# Altium schematic sheet MotherBoard.SchDoc
size A2
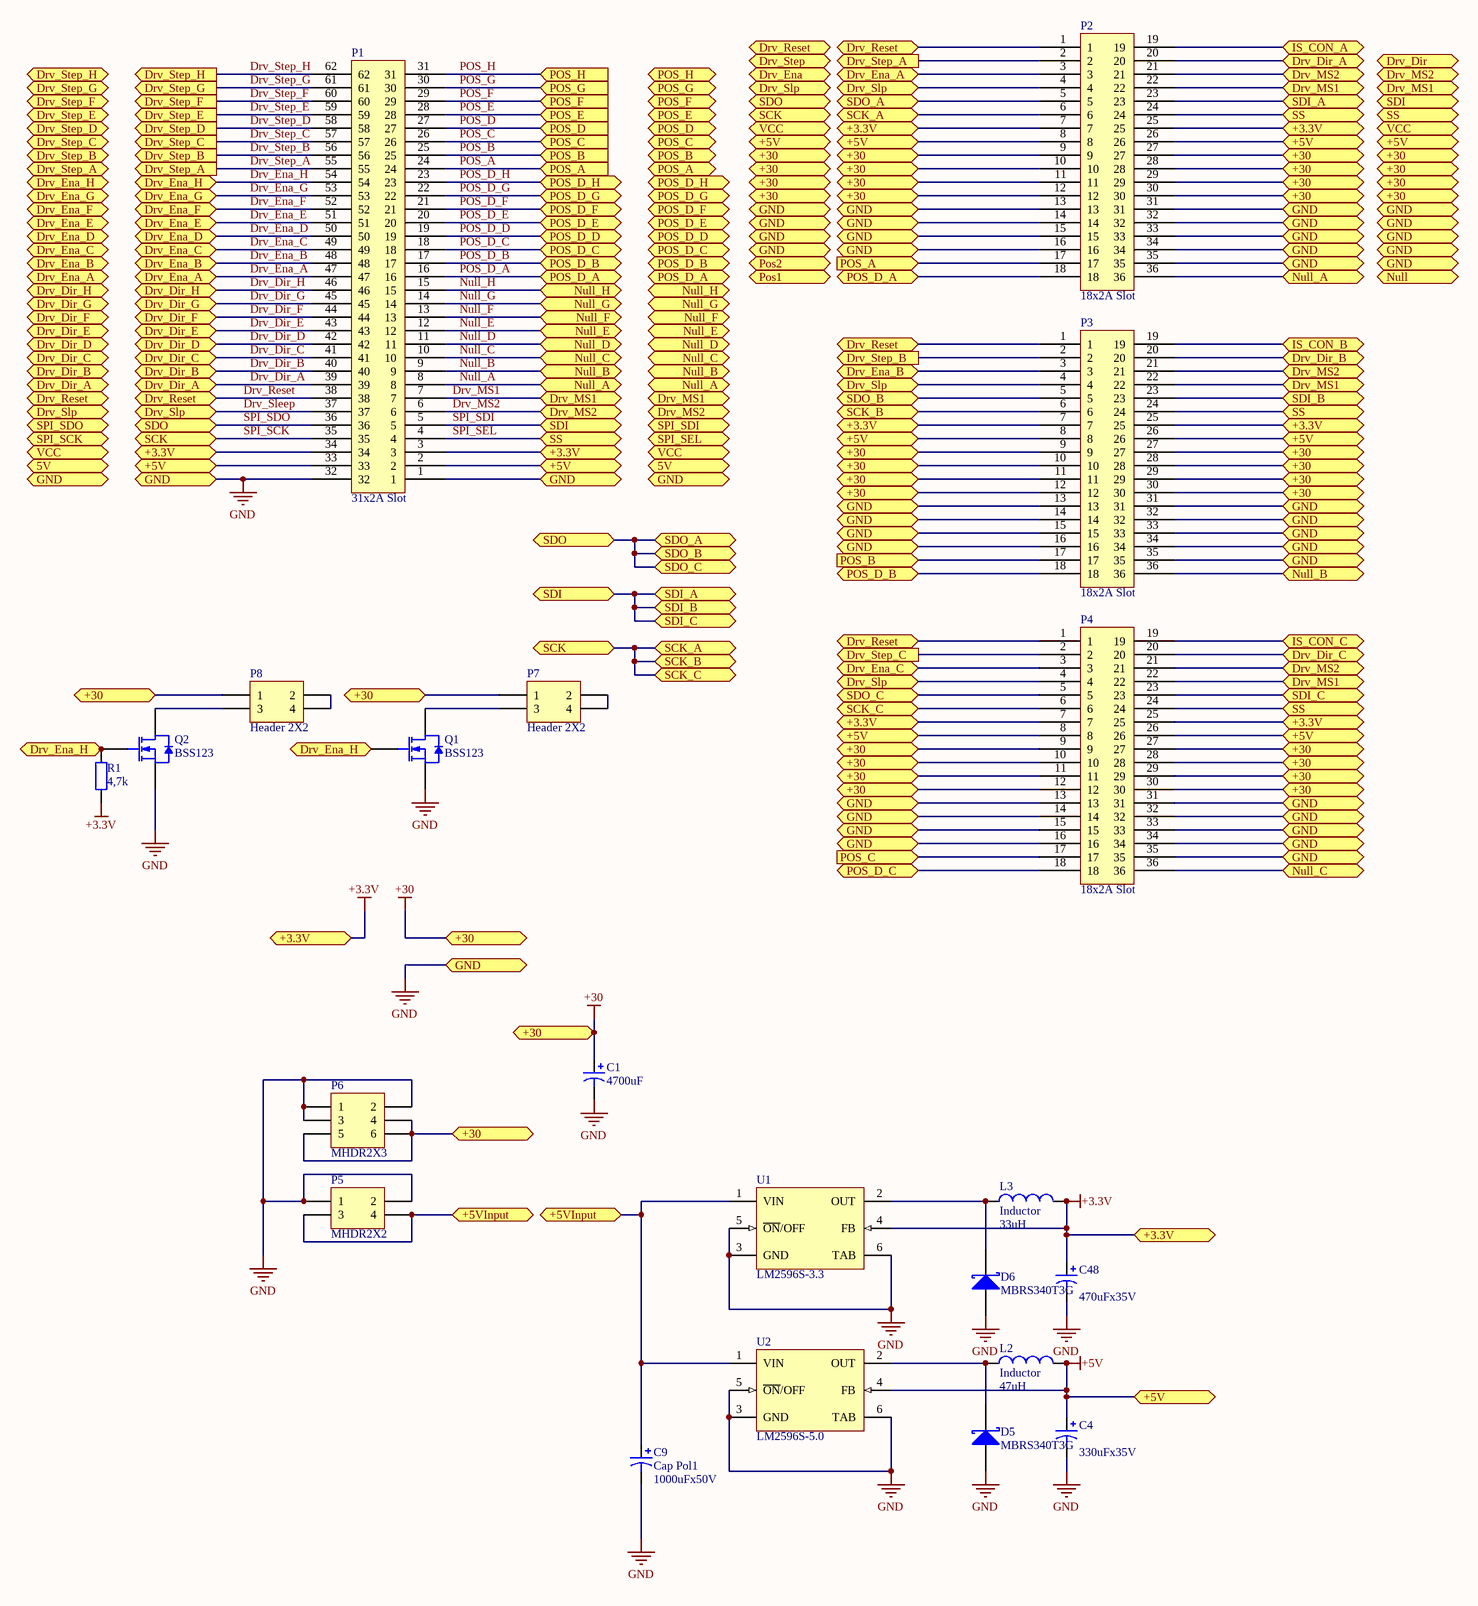
[diagram p0: MotherBoard.SchDoc]

## Parts
C1  value 4700uF  [Cap16x36]  (hidden comment: Cap Pol1)
C4  value 330uFx35V  [Type E]  (hidden comment: Cap Pol1)
C9  Cap Pol1  value 1000uFx50V  [Cap13x25]
C48  value 470uFx35V  [Type E]  (hidden comment: Cap Pol1)
D5  MBRS340T3G  [SMC wbody]
D6  MBRS340T3G  [SMC wbody]
L2  Inductor  value 47uH  [CDRH127/LD]
L3  Inductor  value 33uH  [CDRH127/LD]
P1  31x2A Slot  [SL-62A]
P2  18x2A Slot  [SL-36A]
P3  18x2A Slot  [SL-36A]
P4  18x2A Slot  [SL-36A]
P5  MHDR2X2  [MF-2x2]
P6  MHDR2X3  [MF-2x3]
P7  Header 2X2  [HDR2X2]
P8  Header 2X2  [HDR2X2]
Q1  BSS123  [SOT23_N]
Q2  BSS123  [SOT23_N]
R1  value 4,7k  [RESC2012M]  (hidden comment: Res2)
U1  LM2596S-3.3  [TS5B_N]
U2  LM2596S-5.0  [TS5B_N]

## Ports
5V, +3.3V, +5V, +5VInput, +30, Drv_Dir, Drv_Dir_A, Drv_Dir_B, Drv_Dir_C, Drv_Dir_D, Drv_Dir_E, Drv_Dir_F, Drv_Dir_G, Drv_Dir_H, Drv_Ena, Drv_Ena_A, Drv_Ena_B, Drv_Ena_C, Drv_Ena_D, Drv_Ena_E, Drv_Ena_F, Drv_Ena_G, Drv_Ena_H, Drv_MS1, Drv_MS2, Drv_Reset, Drv_Slp, Drv_Step (out), Drv_Step_A (out), Drv_Step_B (out), Drv_Step_C (out), Drv_Step_D (out), Drv_Step_E (out), Drv_Step_F (out), Drv_Step_G (out), Drv_Step_H (out), GND, IS_CON_A, IS_CON_B, IS_CON_C, Null, Null_A, Null_B, Null_C, Null_D, Null_E, Null_F, Null_G, Null_H, Pos1, Pos2, POS_A (in), POS_B (in), POS_C (in), POS_D (in), POS_D_A, POS_D_B, POS_D_C, POS_D_D, POS_D_E, POS_D_F, POS_D_G, POS_D_H, POS_E (in), POS_F (in), POS_G (in), POS_H (in), SCK, SCK_A, SCK_B, SCK_C, SDI, SDI_A, SDI_B, SDI_C, SDO, SDO_A, SDO_B, SDO_C, SPI_SCK (bidir), SPI_SDI (in), SPI_SDO (out), SPI_SEL (in), SS, VCC

## Nets
+3.3V: C48.1 L3.2 P1.3 P1.34 P2.7 P2.25 P3.7 P3.25 P4.7 P4.25 R1.2 U1.4(FB) ; port +3.3V
+5V: C4.1 L2.2 P1.2 P1.33 P2.8 P2.26 P3.8 P3.26 P4.8 P4.26 U2.4(FB) ; port +5V
+30: C1.1 P2.9 P2.10 P2.11 P2.12 P2.27 P2.28 P2.29 P2.30 P3.9 P3.10 P3.11 P3.12 P3.27 P3.28 P3.29 P3.30 P4.9 P4.10 P4.11 P4.12 P4.27 P4.28 P4.29 P4.30 P6.4 P6.5 P6.6 P7.1 P8.1 ; port +30
GND: C1.2 C4.2 C9.2 C48.2 D5.1(A) D6.1(A) P1.1 P1.32 P2.13 P2.14 P2.15 P2.16 P2.31 P2.32 P2.33 P2.34 P2.35 P3.13 P3.14 P3.15 P3.16 P3.31 P3.32 P3.33 P3.34 P3.35 P4.13 P4.14 P4.15 P4.16 P4.31 P4.32 P4.33 P4.34 P4.35 P5.1 P5.2 P6.1 P6.2 P6.3 Q1.2(S) Q2.2(S) U1.3(GND) U1.5(~{ON}/OFF) U1.6(TAB) U2.3(GND) U2.5(~{ON}/OFF) U2.6(TAB) ; port GND
+5VInput: C9.1 P5.3 P5.4 U1.1(VIN) U2.1(VIN) ; port +5VInput
Drv_Dir_A: P1.39 P2.20 ; port Drv_Dir_A
Drv_Dir_B: P1.40 P3.20 ; port Drv_Dir_B
Drv_Dir_C: P1.41 P4.20 ; port Drv_Dir_C
Drv_Dir_D: P1.42 ; port Drv_Dir_D
Drv_Dir_E: P1.43 ; port Drv_Dir_E
Drv_Dir_F: P1.44 ; port Drv_Dir_F
Drv_Dir_G: P1.45 ; port Drv_Dir_G
Drv_Dir_H: P1.46 ; port Drv_Dir_H
Drv_Ena_A: P1.47 P2.3 ; port Drv_Ena_A
Drv_Ena_B: P1.48 P3.3 ; port Drv_Ena_B
Drv_Ena_C: P1.49 P4.3 ; port Drv_Ena_C
Drv_Ena_D: P1.50 ; port Drv_Ena_D
Drv_Ena_E: P1.51 ; port Drv_Ena_E
Drv_Ena_F: P1.52 ; port Drv_Ena_F
Drv_Ena_G: P1.53 ; port Drv_Ena_G
Drv_Ena_H: P1.54 Q1.1(G) Q2.1(G) R1.1 ; port Drv_Ena_H
Drv_MS1: P1.7 P2.22 P3.22 P4.22 ; port Drv_MS1
Drv_MS2: P1.6 P2.21 P3.21 P4.21 ; port Drv_MS2
Drv_Reset: P1.38 P2.1 P3.1 P4.1 ; port Drv_Reset
Drv_Sleep: P1.37 P2.4 P3.4 P4.4 ; port Drv_Slp
Drv_Step_A: P1.55 P2.2 ; port Drv_Step_A
Drv_Step_B: P1.56 P3.2 ; port Drv_Step_B
Drv_Step_C: P1.57 P4.2 ; port Drv_Step_C
Drv_Step_D: P1.58 ; port Drv_Step_D
Drv_Step_E: P1.59 ; port Drv_Step_E
Drv_Step_F: P1.60 ; port Drv_Step_F
Drv_Step_G: P1.61 ; port Drv_Step_G
Drv_Step_H: P1.62 ; port Drv_Step_H
IS_CON_A: P2.19 ; port IS_CON_A
IS_CON_B: P3.19 ; port IS_CON_B
IS_CON_C: P4.19 ; port IS_CON_C
Null_A: P1.8 P2.36 ; port Null_A
Null_B: P1.9 P3.36 ; port Null_B
Null_C: P1.10 P4.36 ; port Null_C
Null_D: P1.11 ; port Null_D
Null_E: P1.12 ; port Null_E
Null_F: P1.13 ; port Null_F
Null_G: P1.14 ; port Null_G
Null_H: P1.15 ; port Null_H
POS_A: P1.24 P2.17 ; port POS_A
POS_B: P1.25 P3.17 ; port POS_B
POS_C: P1.26 P4.17 ; port POS_C
POS_D: P1.27 ; port POS_D
POS_D_A: P1.16 P2.18 ; port POS_D_A
POS_D_B: P1.17 P3.18 ; port POS_D_B
POS_D_C: P1.18 P4.18 ; port POS_D_C
POS_D_D: P1.19 ; port POS_D_D
POS_D_E: P1.20 ; port POS_D_E
POS_D_F: P1.21 ; port POS_D_F
POS_D_G: P1.22 ; port POS_D_G
POS_D_H: P1.23 ; port POS_D_H
POS_E: P1.28 ; port POS_E
POS_F: P1.29 ; port POS_F
POS_G: P1.30 ; port POS_G
POS_H: P1.31 ; port POS_H
SPI_SCK: P1.35 P2.6 P3.6 P4.6 ; port SCK, port SCK_C, port SCK_A, port SCK_B
SPI_SDI: P1.5 P2.23 P3.23 P4.23 ; port SDI_A, port SDI, port SDI_B, port SDI_C
SPI_SDO: P1.36 P2.5 P3.5 P4.5 ; port SDO_A, port SDO, port SDO_B, port SDO_C
SPI_SEL: P1.4 P2.24 P3.24 P4.24 ; port SS
NetD5_2: D5.2(K) L2.1 U2.2(OUT)
NetD6_2: D6.2(K) L3.1 U1.2(OUT)
NetP7_2: P7.2 P7.4
NetP7_3: P7.3 Q1.3(D)
NetP8_2: P8.2 P8.4
NetP8_3: P8.3 Q2.3(D)

## Library data of the parts
C1 C4 C9 C48 = Cap Pol1: Polarized Capacitor (Radial); Published: 8-Jun-2000; LatestRevisionDate: 17-Jul-2002; LatestRevisionNote: Re-released for DXP Platform.; PackageReference: RB7.6-15; Publisher: Altium Limited
D5 D6 = 30BQ100: Schottky Rectifier; Published: 8-Jun-2000; LatestRevisionDate: 17-Jul-2002; LatestRevisionNote: Re-released for DXP Platform.; DatasheetDocument: PD-2.441A; PackageReference: SMC; Publisher: Altium Limited; Code_JEDEC: DO-214-AB; ComponentLink1Description: Manufacturer Link; ComponentLink1URL: http://www.irf.com/; ComponentLink2Description: Datasheet; ComponentLink2URL: http://www.irf.com/product-info/datasheets/data/30bq100.pdf
L2 L3 = Inductor: Code_IEC: 1005; Published: 8-Jun-2000; LatestRevisionDate: 29-May-2009; LatestRevisionNote: IPC-7351 Footprint Added.; PackageReference: 0402-A; Publisher: Altium Limited; PackageDescription: Chip Inductor; Code_JEITA: 0402
P1 = 31x2A Slot: 31x2 Slot
P5 = MHDR2X2: Header, 2-Pin, Dual row; LatestRevisionDate: 17-Jul-2002; LatestRevisionNote: Re-released for DXP Platform.; Publisher: Altium Limited
P6 = MHDR2X3: Header, 3-Pin, Dual row; LatestRevisionDate: 17-Jul-2002; LatestRevisionNote: Re-released for DXP Platform.; Publisher: Altium Limited
P7 P8 = Header 2X2: Header, 2-Pin, Dual row; LatestRevisionDate: 17-Jul-2002; LatestRevisionNote: Re-released for DXP Platform.; Publisher: Altium Limited
Q1 Q2 = BSS123: N-channel Enhancement Mode Vertical D-MOSFET; Published: 17-Sep-2003; LatestRevisionDate: 12-Dec-2006; LatestRevisionNote: IPC-7351 Footprint Added.; DatasheetVersion: Apr-1995; PackageVersion: May-1999; PackageReference: SOT23; Publisher: Altium Limited; PackageDescription: 3-Pin SOT-23 Package 0.95 mm Pitch, 2.3 mm Lead Span; ComponentLink1Description: Manufacturer Link; ComponentLink1URL: http://www.semiconductors.philips.com/; ComponentLink2Description: Datasheet; ComponentLink2URL: http://www.semiconductors.philips.com/acrobat/datasheets/BSS123_3.pdf
R1 = Res2: Resistor; Published: 8-Jun-2000; LatestRevisionDate: 17-Jul-2002; LatestRevisionNote: Re-released for DXP Platform.; PackageReference: AXIAL-0.4; Publisher: Altium Limited
U1 = LM2596S-3.3: SIMPLE SWITCHER Power Converter 150 KHz 3A Step-Down Voltage Regulator; Manufacturer: National Semiconductor; PackageTopMarking: NSUZXYTT*LM2596S*-3.3 P+; PowerWise: N; Published: 4-Dec-2008; DatasheetVersion: May-2002; PackageVersion: revD, Apr-2005; PackageReference: TS5B; Publisher: Altium Limited; PackageDescription: TO-263, Molded, .400 x .390 x .180in, 5 Lead, .067in Pitch, Surface Mount; CompType: Switcher; PartNumber: LM2596S-3.3; RoHS: O; PinCount: 5; DigiKeyPartNumber: LM2596S-3.3-ND; Code_JEDEC: MO-169-AB; ComponentLink1Description: LM2596 Datasheet; ComponentLink1URL: http://www.national.com/ds/LM/LM2596.pdf; ComponentLink2Description: LM2596 Web Page; ComponentLink2URL: http://www.national.com/pf/LM/LM2596.html; ComponentLink3Description: TS5B Package Page; ComponentLink3URL: http://www.national.com/packaging/folders/ts5b.html
U2 = LM2596S-5.0: SIMPLE SWITCHER Power Converter 150 KHz 3A Step-Down Voltage Regulator; Manufacturer: National Semiconductor; PackageTopMarking: NSUZXYTT*LM2596S*-5.0 P+; PowerWise: N; Published: 4-Dec-2008; DatasheetVersion: May-2002; PackageVersion: revD, Apr-2005; PackageReference: TS5B; Publisher: Altium Limited; PackageDescription: TO-263, Molded, .400 x .390 x .180in, 5 Lead, .067in Pitch, Surface Mount; CompType: Switcher; PartNumber: LM2596S-5.0; RoHS: O; PinCount: 5; DigiKeyPartNumber: LM2596S-5.0-ND; Code_JEDEC: MO-169-AB; ComponentLink1Description: LM2596 Datasheet; ComponentLink1URL: http://www.national.com/ds/LM/LM2596.pdf; ComponentLink2Description: LM2596 Web Page; ComponentLink2URL: http://www.national.com/pf/LM/LM2596.html; ComponentLink3Description: TS5B Package Page; ComponentLink3URL: http://www.national.com/packaging/folders/ts5b.html